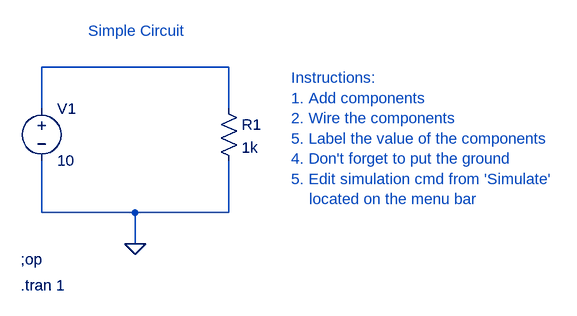
[diagram p0: schematic Simple Circuit.asc]
Simple Circuit.asc, the LTspice schematic file:
Version 4
SHEET 1 932 680
WIRE 336 64 48 64
WIRE 48 128 48 64
WIRE 336 128 336 64
WIRE 48 288 48 208
WIRE 192 288 48 288
WIRE 336 288 336 208
WIRE 336 288 192 288
WIRE 192 336 192 288
FLAG 192 336 0
SYMBOL voltage 48 112 R0
SYMATTR InstName V1
SYMATTR Value 10
SYMBOL res 320 112 R0
SYMATTR InstName R1
SYMATTR Value 1k
TEXT 16 360 Left 2 !;op
TEXT 16 400 Left 2 !.tran 1
TEXT 432 80 Left 2 ;Instructions: \n1. Add components\n2. Wire the components\n5. Label the value of the components\n4. Don't forget to put the ground\n5. Edit simulation cmd from 'Simulate' \n    located on the menu bar
TEXT 120 8 Left 2 ;Simple Circuit

The netlist it stands for:
* Simple Circuit.asc
V1 N001 0 10
R1 N001 0 1k
;op
.tran 1
* Instructions:
* 1. Add components
* 2. Wire the components
* 5. Label the value of the components
* 4. Don't forget to put the ground
* 5. Edit simulation cmd from 'Simulate'
*     located on the menu bar
* Simple Circuit
.backanno
.end